# EAGLE design ep-project-team12-2 (EAGLE 9.6.2)

## Sheet 1 of 2
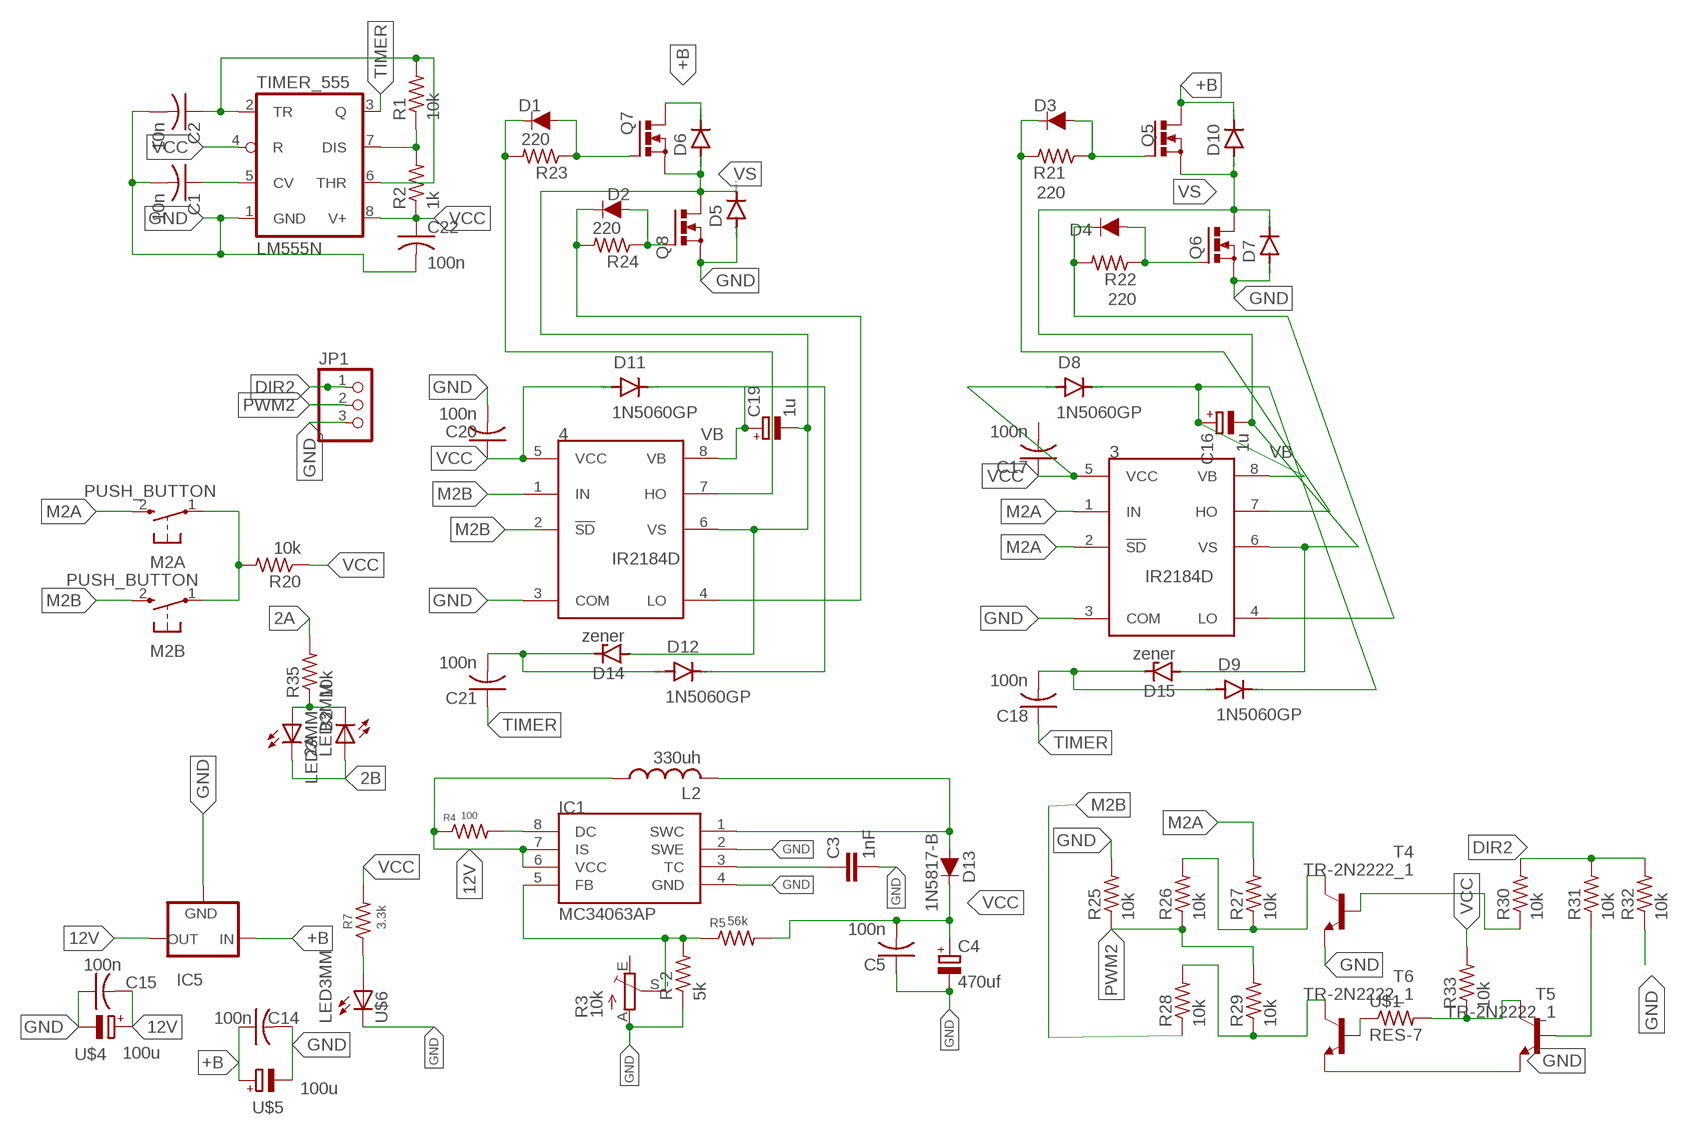
[diagram p0: schematic, sheet 1]

### Parts
2A  LED3MM  [LED3MM]
3  IR2184D  [DIL08]
4  IR2184D  [DIL08]
B2  LED3MM  [LED3MM]
C1  10n  C-US025-025X050  [C025-025X050]
C2  10n  C-US025-025X050  [C025-025X050]
C3  1nF  CAPACITOR  [C025-025X050]
C4  470uf  CAP_POL  [E3,5-8]
C5  100n  C-US025-025X050  [C025-025X050]
C14  100n  C-US025-025X050  [C025-025X050]
C15  100n  C-US025-025X050  [C025-025X050]
C16  1u  CPOL-EUE5-5  [E5-5]
C17  100n  C-US025-025X050  [C025-025X050]
C18  100n  C-US025-025X050  [C025-025X050]
C19  1u  CPOL-EUE5-5  [E5-5]
C20  100n  C-US025-025X050  [C025-025X050]
C21  100n  C-US025-025X050  [C025-025X050]
C22  100n  C-US025-025X050  [C025-025X050]
D1  1A/50V/1.1V  DIODE(1A)-PTH  [DIODE-1N4001]
D2  1A/50V/1.1V  DIODE(1A)-PTH  [DIODE-1N4001]
D3  1A/50V/1.1V  DIODE(1A)-PTH  [DIODE-1N4001]
D4  1A/50V/1.1V  DIODE(1A)-PTH  [DIODE-1N4001]
D5  BY396  [DO201-15]
D6  BY396  [DO201-15]
D7  BY396  [DO201-15]
D8  1N5060GP  [DO15-12]
D9  1N5060GP  [DO15-12]
D10  BY396  [DO201-15]
D11  1N5060GP  [DO15-12]
D12  1N5060GP  [DO15-12]
D13  1N5817-B  DIODE(1A)-PTH  [DIODE-1N4001]
D14  zener  BZD23  [SOD81]
D15  zener  BZD23  [SOD81]
IC1  MC34063AP  [DIL08]
IC5  78XXS  [78XXS]
JP1  PINHD-3_DATA  [1X03_DATA]
L2  330uh  L-USWE-TPC  [POWER-CHOKE_WE-TPC]
M2A  PUSH_BUTTON  [B3F-10XX]
M2B  PUSH_BUTTON  [B3F-10XX]
Q5  MOSFET_NTO220BV  [TO220BV]
Q6  MOSFET_NTO220BV  [TO220BV]
Q7  MOSFET_NTO220BV  [TO220BV]
Q8  MOSFET_NTO220BV  [TO220BV]
R1  10k  R-US_0204/7  [0204/7]
R2  1k  R-US_0204/7  [0204/7]
R3  10k  TRIM_EU-CA6V  [CA6V]
R4  100  RES-7  [0204/7]
R5  56k  RES-7  [0204/7]
R7  3.3k  RES-7  [0204/7]
R20  10k  R-US_0204/7  [0204/7]
R21  220  R-US_0204/7  [0204/7]
R22  220  R-US_0204/7  [0204/7]
R23  220  R-US_0204/7  [0204/7]
R24  220  R-US_0204/7  [0204/7]
R25  10k  R-US_0204/7  [0204/7]
R26  10k  R-US_0204/7  [0204/7]
R27  10k  R-US_0204/7  [0204/7]
R28  10k  R-US_0204/7  [0204/7]
R29  10k  R-US_0204/7  [0204/7]
R30  10k  R-US_0204/7  [0204/7]
R31  10k  R-US_0204/7  [0204/7]
R32  10k  R-US_0204/7  [0204/7]
R33  10k  R-US_0204/7  [0204/7]
R35  10k  R-US_0204/7  [0204/7]
R-2  5k  RES-7  [0204/7]
T4  TR-2N2222_1  [TO92-EBC]
T5  TR-2N2222_1  [TO92-EBC]
T6  TR-2N2222_1  [TO92-EBC]
TIMER_555  LM555N  [DIL08]
U$1  RES-7  [0204/7]
U$4  100u  CAP_POL  [E3,5-8]
U$5  100u  CAP_POL  [E3,5-8]
U$6  LED3MM  [LED3MM]

### Nets
2A: R35.2
2B: 2A.K(C) B2.A
12V: C15.2 IC1.6(VCC) IC1.7(IS) IC5.OUT L2.1 R4.1 U$4.+
+B: C14.1 D6.C D10.C IC5.IN Q5.D Q7.D U$5.+
DIR2: JP1.1 R30.2 R31.2 R32.2
GND: 3.3(COM) 4.3(COM) C1.2 C2.2 C3.2 C4.- C5.1 C14.2 C15.1 C20.2 C22.2 D5.A D7.A IC1.2(SWE) IC1.4(GND) IC5.GND JP1.3 Q6.S Q8.S R3.A R25.2 R32.1 R-2.1 T4.E T5.E T6.E TIMER_555.1(GND) U$4.- U$5.- U$6.K(C)
M2A: 3.1(IN) 3.2(!SD) M2A.2(S) R27.2
M2B: 4.1(IN) 4.2(!SD) M2B.2(S) R28.1
N$2: C1.1 TIMER_555.5(CV)
N$3: R1.1 R2.2 TIMER_555.7(DIS)
N$4: C2.1 R1.2 TIMER_555.2(TR) TIMER_555.6(THR)
N$5: D4.A Q6.G R22.1
N$6: 3.4(LO) D4.C R22.2
N$7: M2A.1(P) M2B.1(P) R20.2
N$8: T6.B U$1.1
N$9: C3.1 IC1.3(TC)
N$10: D13.A IC1.1(SWC) L2.2
N$11: 4.7(HO) D1.C R23.2
N$12: IC1.5(FB) R3.S R5.1 R-2.2
N$13: 4.4(LO) D2.C R24.2
N$15: IC1.8(DC) R4.2
N$16: R7.1 U$6.A
N$25: D3.A Q5.G R21.1
N$30: 3.7(HO) D3.C R21.2
N$31: C18.2 D9.A D15.C
N$32: D2.A Q8.G R24.1
N$33: D1.A Q7.G R23.1
N$36: C21.2 D12.A D14.C
N$37: R28.2 R29.1 T6.C
N$38: R26.2 R27.1 T4.C
N$39: R30.1 T4.B
N$40: R33.1 T5.C U$1.2
N$41: R31.1 T5.B
N$46: 2A.A B2.K(C) R35.1
PWM2: JP1.2 R25.1 R26.1 R29.2
TIMER: C18.1 C21.1 TIMER_555.3(Q)
VB: 3.8(VB) 4.8(VB) C16.+ C19.+ D8.C D9.C D11.C D12.C
VCC: 3.5(VCC) 4.5(VCC) C4.+ C5.2 C17.1 C20.1 C22.1 D8.A D11.A D13.C R2.1 R5.2 R7.2 R20.1 R33.2 TIMER_555.4(R) TIMER_555.8(V+)
VS: 3.6(VS) 4.6(VS) C16.- C19.- D5.C D6.A D7.C D10.A D14.A D15.A Q5.S Q6.D Q7.S Q8.D
Unconnected: C17.2 R3.E

## Sheet 2 of 2

## Library data of the parts
2A B2 = MIA_LIBRARY-2-2-2:LED3MM
3 4 = MIA_LIBRARY-2-2-2:IR2184
C1 C2 C5 C14 C15 C17 C18 C20-C22 = rcl8:C-US: CAPACITOR, American symbol; SPICEPREFIX: C
C3 = MIA_LIBRARY-2-2-2:CAPACITOR; SPICEPREFIX: C
C4 = MIA_LIBRARY-2-2-2:CAP_POL; SPICEPREFIX: C
C16 C19 = rcl8:CPOL-EU: POLARIZED CAPACITOR, European symbol; SPICEPREFIX: C
D1-D4 = MIA_LIBRARY-2-2-2:DIODE(1A): Diode These are standard reverse protection diodes and small signal diodes. SparkFun Products: SparkFun SparkPunk Sound Kit <https://www.sparkfun.com/products/11177> SparkFun ESP8266 Thing <https://www.sparkfun.com/products/13231>; PROD_ID: DIO-09176
D5-D7 D10 = diode:BY396: DIODE Si,100 V, 3 A
D8 D9 D11 D12 = diode:1N5060GP: DIODE controlled avalanche rectifier
D13 = MIA_LIBRARY-2-2-2:DIODE(1A): Diode These are standard reverse protection diodes and small signal diodes. SparkFun Products: SparkFun SparkPunk Sound Kit <https://www.sparkfun.com/products/11177> SparkFun ESP8266 Thing <https://www.sparkfun.com/products/13231>; PROD_ID: DIO-09176; SPICEPREFIX: D; VALUE: 1A/50V/1.1V
D14 D15 = diode:BZD23: Z DIODE
IC1 = MIA_LIBRARY-2-2-2:MC34063; SPICEPREFIX: X
IC5 = MIA_LIBRARY-2-2-2:78XXS: VOLTAGE REGULATOR
JP1 = MIA_LIBRARY-2-2-2:PINHD-3_DATA: PIN HEADER
L2 = rcl:L-US: INDUCTOR, American symbol; SPICEPREFIX: L
M2A M2B = MIA_LIBRARY-2-2-2:PUSH_BUTTON: OMRON SWITCH
Q5-Q8 = MIA_LIBRARY-2-2-2:MOSFET_N: Power MOSFET N-Channel
R1 R2 R20-R33 R35 = rcl8:R-US_: RESISTOR, American symbol; SPICEPREFIX: R
R3 = MIA_LIBRARY-2-2-2:TRIM_EU-: POTENTIOMETER; SPICEPREFIX: J
R4 R5 R7 = MIA_LIBRARY-2-2-2:RES-7; SPICEPREFIX: R
R-2 = MIA_LIBRARY-2-2-2:RES-7
T4-T6 = MIA_LIBRARY-2-2-2:TR-2N2222_1: NPN TRANSISTOR; SPICEPREFIX: J
TIMER_555 = linear:*555: TIMER
U$1 = MIA_LIBRARY-2-2-2:RES-7; SPICEPREFIX: B
U$4 U$5 = MIA_LIBRARY-2-2-2:CAP_POL
U$6 = MIA_LIBRARY-2-2-2:LED3MM; SPICEPREFIX: B

## Board
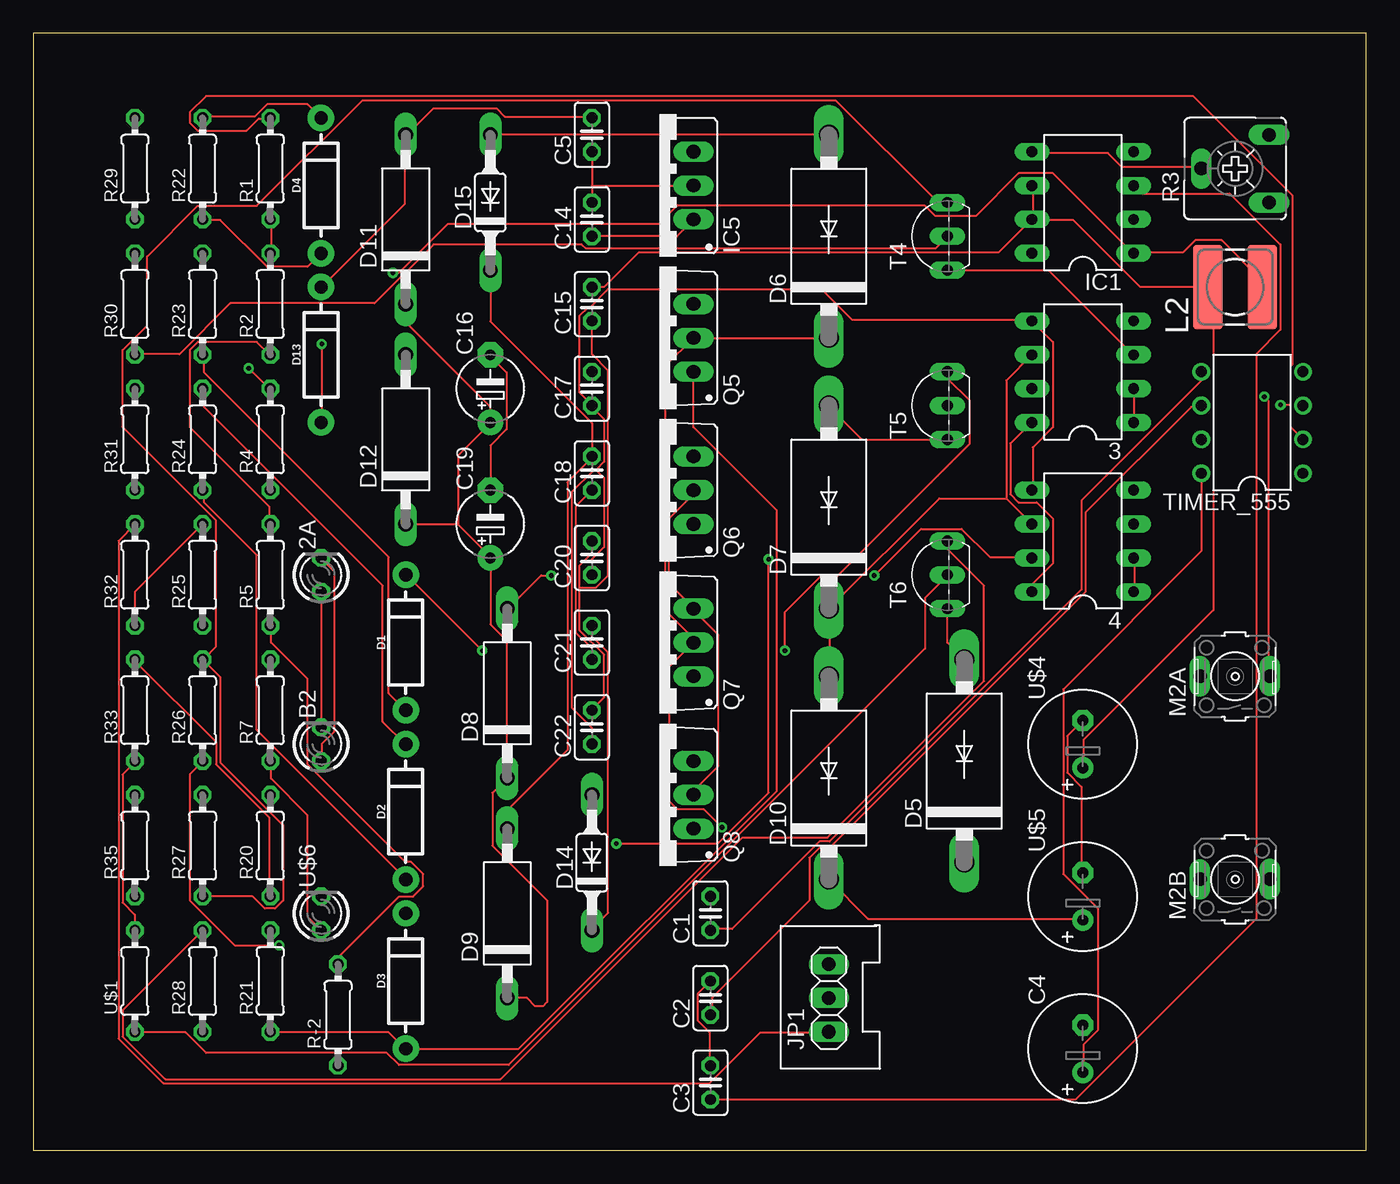
[diagram p1: board, top side]
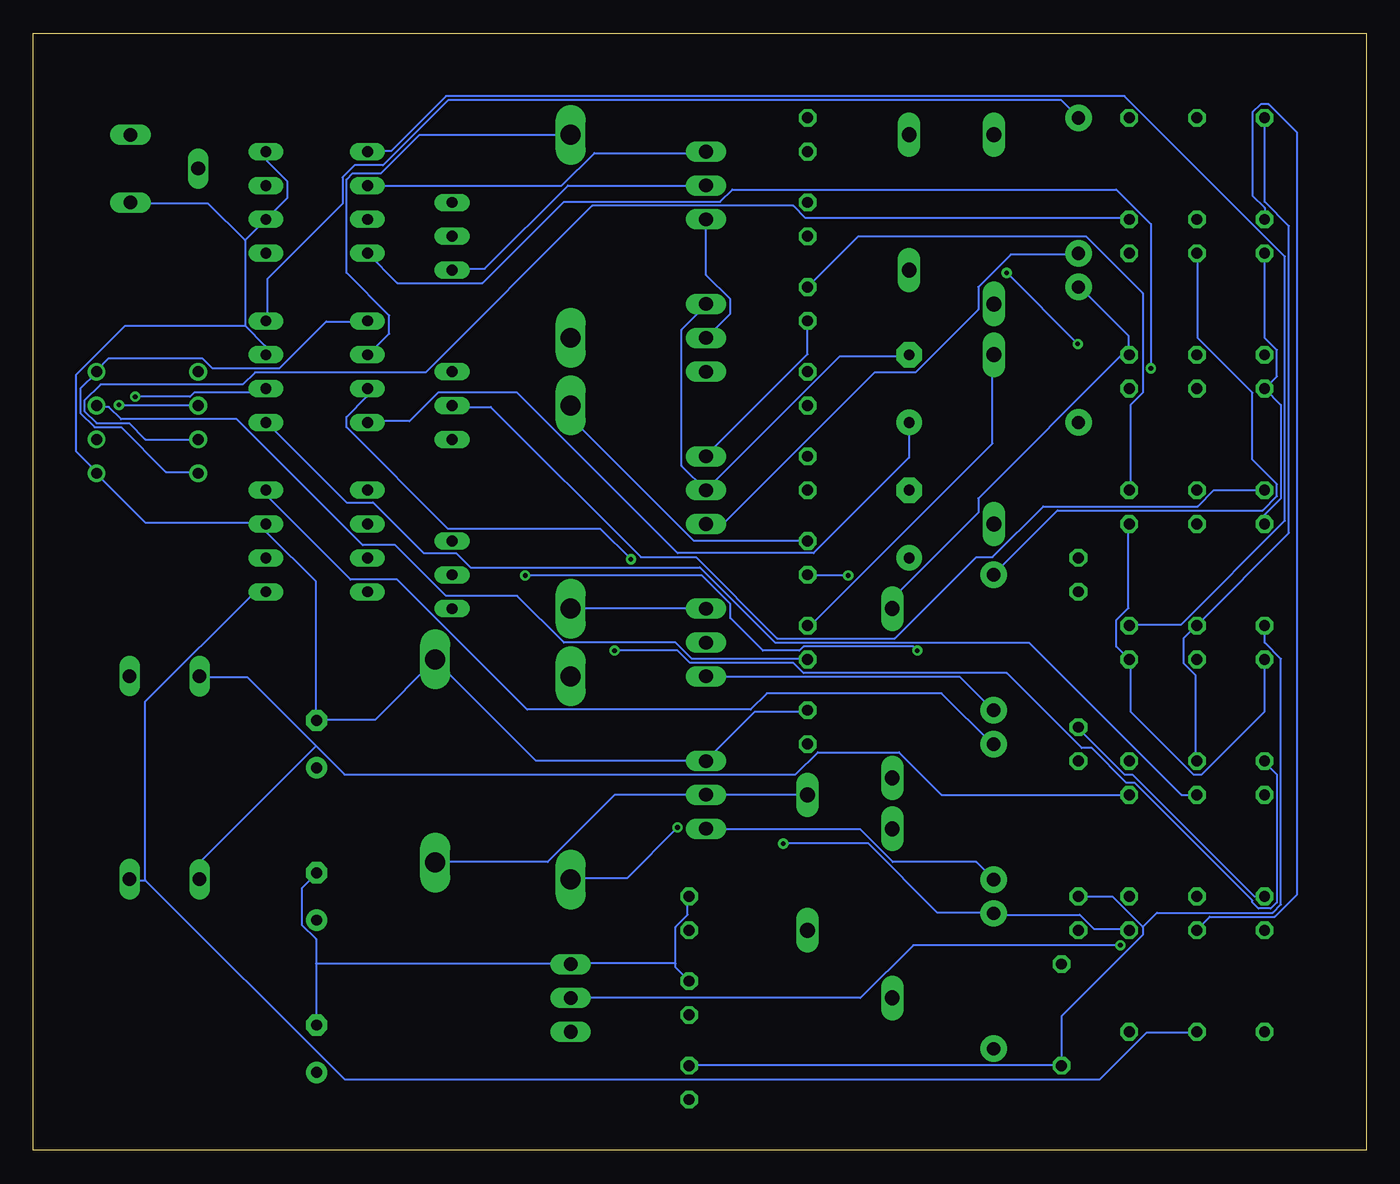
[diagram p2: board, bottom side, seen from below]

Size 100 x 83.81 mm. Coordinates in mm from the lower left corner, seen from the top.
Outline: 0,0 100,0 100,83.81 0,83.81 0,0
Copper layers (1*16): Top 0.035mm / dielectric 1.7mm / Bottom 0.035mm
Design rules "default *": minimum track width 6mil, minimum drill 0.35mm, track to track 6mil, track to pad 6mil, pad to pad 6mil, via to via 6mil, smd to smd 6mil, copper to edge 40mil, drill to drill 6mil, minimum pad ring 10mil, minimum via ring 8mil, stop-mask expansion 4mil, vias tented up to drill 0mil, thermal gap 10mil

### Footprints (pad centres in the part's own frame; a part is rotated, then mirrored left to right if it is on the bottom)
LED3MM = drill 0.813 octagon: A -1.27,0; K 1.27,0
DIL08 = drill 0.813 long: 1 -3.81,-3.81; 2 -1.27,-3.81; 3 1.27,-3.81; 4 3.81,-3.81; 5 3.81,3.81; 6 1.27,3.81; 7 -1.27,3.81; 8 -3.81,3.81
C025-025X050 = drill 0.813 octagon: 1 -1.27,0; 2 1.27,0
E3,5-8 = drill 0.813 pad 1.6: + -1.778,0 | drill 0.813 pad 1.6 octagon: - 1.778,0
E5-5 = drill 0.813 pad 1.905: + -2.54,0 | drill 0.813 pad 1.905 octagon: - 2.54,0
DIODE-1N4001 = drill 1 pad 1.981: A -5.08,0; C 5.08,0
DO201-15 = drill 1.499 long: A 7.62,0; C -7.62,0
DO15-12 = drill 1.118 long: A 6.35,0; C -6.35,0
SOD81 = drill 1.118 long: A 5.08,0; C -5.08,0
78XXS = drill 1.016 long: GND 0,-2.54; IN -2.54,-2.54; OUT 2.54,-2.54
1X03_DATA = drill 1.016 long: 1 -2.54,0; 2 0,0; 3 2.54,0
POWER-CHOKE_WE-TPC = smd 6.3 x 2.2: 1 0,2.05; 2 0,-2.05
B3F-10XX = drill 1.016 long: 1 0.013,2.636; 2 0.029,-2.605
TO220BV = drill 1.016 long: D 0,-2.54; G -2.54,-2.54; S 2.54,-2.54
0204/7 = drill 0.813 octagon: 1 -3.81,0; 2 3.81,0
CA6V = drill 1.016 long: A -2.54,-2.54; E 2.54,-2.54; S 0,2.54
TO92-EBC = drill 0.813 long: B 0,-1.27; C 2.54,-1.27; E -2.54,-1.27
DIL08' = drill 0.813 pad 1.27: 1 -3.81,-3.81; 2 -1.27,-3.81; 3 1.27,-3.81; 4 3.81,-3.81; 5 3.81,3.81; 6 1.27,3.81; 7 -1.27,3.81; 8 -3.81,3.81

### Placement (x,y rotation side)
2A  21.59,43.18 90 top
3  78.74,58.42 90 top
4  78.74,45.72 90 top
B2  21.59,30.48 90 top
C1  50.8,17.78 90 top
C2  50.8,11.43 90 top
C3  50.8,5.08 90 top
C4  78.74,7.62 90 top
C5  41.91,76.2 90 top
C14  41.91,69.85 90 top
C15  41.91,63.5 90 top
C16  34.29,57.15 90 top
C17  41.91,57.15 90 top
C18  41.91,50.8 90 top
C19  34.29,46.99 90 top
C20  41.91,44.45 90 top
C21  41.91,38.1 90 top
C22  41.91,31.75 90 top
D1  27.94,38.1 90 top
D2  27.94,25.4 90 top
D3  27.94,12.7 90 top
D4  21.59,72.39 90 top
D5  69.85,29.21 90 top
D6  59.69,68.58 90 top
D7  59.69,48.26 90 top
D8  35.56,34.29 90 top
D9  35.56,17.78 90 top
D10  59.69,27.94 90 top
D11  27.94,69.85 90 top
D12  27.94,53.34 90 top
D13  21.59,59.69 90 top
D14  41.91,21.59 90 top
D15  34.29,71.12 90 top
IC1  78.74,71.12 90 top
IC5  46.99,72.39 90 top
JP1  59.69,11.43 90 top
L2  90.17,64.77 90 top
M2A  90.17,35.56 90 top
M2B  90.17,20.32 90 top
Q5  46.99,60.96 90 top
Q6  46.99,49.53 90 top
Q7  46.99,38.1 90 top
Q8  46.99,26.67 90 top
R1  17.78,73.66 90 top
R2  17.78,63.5 90 top
R3  90.17,73.66 90 top
R4  17.78,53.34 90 top
R5  17.78,43.18 90 top
R7  17.78,33.02 90 top
R20  17.78,22.86 90 top
R21  17.78,12.7 90 top
R22  12.7,73.66 90 top
R23  12.7,63.5 90 top
R24  12.7,53.34 90 top
R25  12.7,43.18 90 top
R26  12.7,33.02 90 top
R27  12.7,22.86 90 top
R28  12.7,12.7 90 top
R29  7.62,73.66 90 top
R30  7.62,63.5 90 top
R31  7.62,53.34 90 top
R32  7.62,43.18 90 top
R33  7.62,33.02 90 top
R35  7.62,22.86 90 top
R-2  22.86,10.16 90 top
T4  67.31,68.58 90 top
T5  67.31,55.88 90 top
T6  67.31,43.18 90 top
TIMER_555  LM555N  [DIL08']  91.44,54.61 90 top
U$1  7.62,12.7 90 top
U$4  78.74,30.48 90 top
U$5  78.74,19.05 90 top
U$6  21.59,17.78 90 top

### Tracks (layer width: path | path; a pad name or v marks a point on that pad's centre or on a via)
2B
  Top 0.152: B2.A 21.64,29.26 21.64,30.48 22.55,31.39 22.55,43.43 21.64,44.35 2A.K
12V
  Top 0.152: IC1.7 74.98,69.95 74.98,72.39 IC1.6 | U$4.+ 78.79,28.8 78.79,30.79 88.54,40.54 88.54,64.47 88.24,64.77 L2.1 83.06,64.77 78.03,69.8 74.98,69.8 IC1.7 | C15.2 42.82,64.77 45.41,67.36 72.39,67.36 74.83,69.8 IC1.7
  Bottom 0.152: C15.2 38.1,68.58 21.03,68.58 16.76,64.31 16.76,56.84 17.68,55.93 17.68,49.53 R4.1 | IC1.6 60.35,72.39 57.91,74.83 49.53,74.83 IC5.OUT
+B  (via drill 0.35)
  Top 0.152: D10.C 62.64,17.37 78.64,17.37 U$5.+ | C14.1 48.31,68.58 49.53,69.8 IC5.IN | D6.C Q5.D 47.4,58.83 47.4,40.54 49.53,38.41 Q7.D 47.7,36.27 47.7,26.21 48.31,25.6 50.29,25.6 v51.66,24.23
  Bottom 0.152: IC5.IN 49.53,65.68 47.7,63.86 47.7,62.79 Q5.D | v51.66,24.23 55.47,20.42 59.59,20.42 D10.C
DIR2
  Top 0.152: JP1.1 59.59,8.84 54.56,8.84 50.75,5.03 9.75,5.03 6.4,8.38 6.4,45.72 7.62,46.94 R32.2
  Bottom 0.152: R32.2 7.62,47.7 6.4,48.92 6.4,55.93 R31.2 6.71,58.06 6.71,60.05 7.62,60.96 R30.2
GND
  Top 0.152: C5.1 41.91,72.39 | 41.91,72.39 C14.2 | 41.91,72.39 IC5.GND | T4.E 68.58,65.99 76.2,65.99 82.45,59.74 3.3 | T5.E 62.18,53.34 59.74,55.78 D7.A | C20.2 41.91,44.81 41,43.89 41,42.22 | 41,42.22 41,39.01 42.82,37.19 42.82,33.98 41.91,33.07 C22.2 | C15.1 41.91,59.74 43.13,58.52 43.13,43.13 42.22,42.22 41,42.22 | R32.1 7.62,41.91 R25.2 | C2.2 49.84,11.73 49.84,9.75 50.75,8.84 50.75,6.4 C3.2 | T6.E 68.58,38.1 D5.A | U$4.- 77.57,31.09 77.57,28.35 78.64,27.28 78.64,20.88 U$5.-
  Bottom 0.152: 84.12,61.87 82.6,60.35 82.6,59.74 3.3 | 84.12,68.28 84.12,61.87 | 84.12,68.28 IC1.2 80.92,71.48 80.92,72.69 82.45,74.22 82.45,74.83 IC1.4 | 84.12,68.28 86.87,71.02 92.66,71.02 R3.A | IC5.GND 59.89,72.39 66.14,66.14 68.58,66.14 T4.E | C15.1 41.91,59.74 49.53,52.12 Q6.S | 49.53,29.26 45.87,32.92 41.91,32.92 C22.2 | C20.2 50.44,45.72 59.59,54.86 59.59,55.78 D7.A | 22.86,6.4 22.86,10.06 16.76,16.15 16.76,16.76 | 16.76,16.76 19.05,19.05 U$6.K | R32.1 7.62,38.1 6.4,36.88 6.4,18.44 7.01,17.83 15.7,17.83 16.76,16.76 | 51.82,14.02 51.82,13.72 C2.2 | 51.82,14.02 51.82,16.76 50.9,17.68 50.9,19.05 C1.2 | 51.82,14.02 59.59,14.02 JP1.3 59.74,14.02 78.79,14.02 | 78.79,14.02 78.79,15.85 79.86,16.92 79.86,19.66 78.79,20.73 U$5.- | 78.79,14.02 78.79,9.45 C4.- | 22.86,6.4 50.75,6.4 C3.2 | 22.86,6.4 R-2.1 | 49.53,29.26 62.33,29.26 69.8,36.73 D5.A 74.37,32.31 78.64,32.31 U$4.- 78.79,32.31 78.79,42.67 82.45,46.33 82.45,46.94 4.3 82.6,47.09 91.59,47.09 95.25,50.75 TIMER_555.1 95.25,50.9 96.77,52.43 96.77,58.22 93.12,61.87 84.12,61.87 | 49.53,29.26 Q8.S
M2A  (via drill 0.35)
  Top 0.152: 3.2 82.6,57.15 82.6,54.71 3.1 | v92.35,56.54 92.66,56.24 92.66,35.66 M2A.2
  Bottom 0.152: R27.2 13.87,26.67 25.3,38.1 44.35,38.1 49.99,43.74 67.21,43.74 68.28,44.81 70.71,44.81 74.52,48.62 76.5,48.62 82.45,54.56 3.1 | v92.35,56.54 88.24,56.54 87.94,56.84 82.91,56.84 82.6,57.15 3.2
M2B
  Top 0.152: 4.1 82.6,41.91 82.6,44.35 4.2
  Bottom 0.152: 91.59,20.27 76.66,5.33 19.96,5.33 16.46,8.84 12.8,8.84 R28.1 | 91.59,20.27 92.66,20.27 M2B.2 | 4.1 83.36,41.91 91.59,33.68 91.59,20.27
N$2
  Top 0.152: TIMER_555.5 87.63,57.76 78.64,48.77 78.64,42.06 59.74,23.16 58.98,23.16 52.43,16.61 50.9,16.61 C1.1
N$3
  Top 0.152: R2.2 17.83,67.36 17.83,69.8 R1.1
  Bottom 0.152: TIMER_555.7 91.59,53.34 92.81,54.56 95.25,54.56 96.16,55.47 96.16,56.24 94.94,57.45 84.28,57.45 83.36,58.37 70.56,58.37 58.06,70.87 42.98,70.87 42.06,69.95 17.83,69.95 R1.1
N$4  (via drill 0.35)
  Top 0.152: C2.1 50.9,10.21 50.9,11.43 58.22,18.75 58.22,21.95 59.13,22.86 59.89,22.86 78.94,41.91 78.94,47.85 86.87,55.78 87.63,55.78 TIMER_555.6 | 94.34,55.93 94.34,54.25 TIMER_555.2 | 94.34,55.93 94.34,58.83 94.49,58.98 94.49,71.63 87.02,79.1 12.95,79.1 11.73,77.88 11.73,77.11 12.34,76.5 16,76.5 16.92,77.42 17.68,77.42 R1.2 | 94.34,55.93 v93.57,55.93
  Bottom 0.152: v93.57,55.93 87.63,55.93 TIMER_555.6
N$5
  Top 0.152: D4.A 20.57,66.29 17.53,66.29 14.02,69.8 12.8,69.8 R22.1
  Bottom 0.152: Q6.G 49.53,47.09 48.16,47.09 36.88,58.37 33.83,58.37 29.11,63.09 29.11,64.77 26.67,67.21 21.64,67.21 D4.A
N$6
  Top 0.152: D4.C 20.57,78.49 17.53,78.49 16.61,77.57 12.8,77.57 R22.2
  Bottom 0.152: 3.4 82.45,62.33 82.45,65.38 76.81,71.02 76.81,73 75.89,73.91 73.76,73.91 68.89,78.79 22.86,78.79 21.64,77.57 D4.C
N$7
  Bottom 0.152: R20.2 31.85,26.67 35.05,29.87 41.15,29.87 42.82,28.19 76.66,28.19 78.79,30.33 | 78.79,30.33 83.97,35.51 87.48,35.51 M2A.1 | 78.79,30.33 87.48,21.64 87.48,20.42 M2B.1
N$8
  Top 0.152: U$1.1 7.62,8.84 11.43,8.84 12.95,7.32 26.52,7.32 27.43,6.4 35.66,6.4 66.9,37.64 66.9,41.45 68.58,43.13 T6.B
N$9
  Top 0.152: C3.1 78.18,3.81 91.75,17.37 91.75,59.74 93.57,61.57 93.57,67.97 89.76,71.78 83.21,71.78 82.6,72.39 IC1.3
N$10  (via drill 0.35)
  Top 0.152: L2.2 92.2,64.77 92.2,65.23 89.15,68.28 87.17,68.28 86.26,67.36 82.6,67.36 IC1.1 82.45,67.36 76.5,73.3 73.91,73.3 70.71,70.1 67.67,70.1 66.9,70.87 48.31,70.87 46.94,69.49 31.09,69.49 27.43,65.84 v26.98,65.84 | v21.64,60.5 21.64,54.71 D13.A
  Bottom 0.152: v26.98,65.84 v21.64,60.5
N$11  (via drill 0.35)
  Top 0.152: v63.09,43.13 66.6,46.63 69.65,46.63 71.78,44.5 74.83,44.5 4.7 | v33.68,37.49 28.04,43.13 D1.C
  Bottom 0.152: R23.2 12.65,67.21 12.65,60.96 8.53,56.84 8.53,51.82 6.71,49.99 6.71,49.07 7.77,48.01 23.16,48.01 27.89,43.28 D1.C | v63.09,43.13 49.84,43.13 47.7,41 47.7,39.93 45.26,37.49 42.52,37.49 42.22,37.8 33.98,37.8 v33.68,37.49
N$12
  Top 0.152: IC1.5 74.98,74.83 80.62,74.83 81.69,73.76 87.63,73.76 R3.S | R-2.2 22.86,14.48 27.43,19.05 28.5,19.05 29.26,19.81 29.26,20.73 28.35,21.64 27.89,21.64 20.57,28.96 20.57,35.36 17.83,38.1 17.83,39.32 R5.1
  Bottom 0.152: IC1.5 74.83,74.98 73.15,74.98 69.04,79.1 18.14,79.1 6.1,67.06 6.1,47.24 13.87,39.47 17.68,39.47 R5.1
N$13
  Top 0.152: R24.2 12.8,57.15 12.8,55.78 26.21,42.37 26.21,32.16 27.89,30.48 D2.C
  Bottom 0.152: 4.4 82.45,49.53 82.45,49.07 76.2,42.82 72.69,42.82 62.94,33.07 46.18,33.07 44.96,34.29 31.85,34.29 28.04,30.48 D2.C
N$15  (via drill 0.35)
  Top 0.152: v16.15,58.67 17.68,57.15 R4.2
  Bottom 0.152: v16.15,58.67 16.15,69.49 18.75,72.08 47.55,72.08 48.46,71.17 60.2,71.17 66.29,65.08 72.69,65.08 IC1.8
N$16
  Top 0.152: U$6.A 20.57,17.53 20.57,25.15 17.83,27.89 17.83,29.11 R7.1
N$25
  Top 0.152: R21.1 17.83,8.84 26.67,8.84 27.89,7.62 D3.A 36.42,7.62 55.78,26.98 55.78,48.01 49.53,54.25 Q5.G
N$30  (via drill 0.35)
  Top 0.152: v55.17,44.35 55.17,26.82 51.36,23.01 v43.74,23.01
  Bottom 0.152: R21.2 17.83,16.61 20.42,16.61 21.49,17.68 27.89,17.68 D3.C 28.04,17.83 32.16,17.83 37.34,23.01 v43.74,23.01 | v55.17,44.35 57.45,46.63 68.89,46.63 76.5,54.25 76.5,55.02 74.98,56.54 74.98,57.15 3.7
N$31
  Top 0.152: D15.C 34.29,62.18 41.91,54.56 C18.2 41.91,51.97 40.08,50.14 40.08,30.02 35.66,25.6 35.66,24.23 D9.A
N$32
  Top 0.152: R24.1 12.8,49.53 12.8,48.62 16.76,44.65 16.76,31.55 27.89,20.42 D2.A
  Bottom 0.152: D2.A 29.26,21.64 35.51,21.64 37.95,24.08 49.53,24.08 Q8.G
N$33
  Top 0.152: D1.A 26.67,34.29 26.67,44.5 12.8,58.37 12.8,59.59 R23.1
  Bottom 0.152: Q7.G 49.53,35.51 30.48,35.51 28.04,33.07 D1.A
N$36
  Top 0.152: C21.2 41.91,38.56 43.13,37.34 43.13,17.83 41.91,16.61 D14.C
  Bottom 0.152: D12.A 28.04,59.59 28.04,53.03 41.6,39.47 41.91,39.47 C21.2
N$37
  Top 0.152: T6.C 68.58,45.11 71.32,42.37 71.32,35.2 59.59,23.47 53.19,23.47 35.05,5.33 9.91,5.33 6.71,8.53 6.71,10.52 R28.2
  Bottom 0.152: R29.1 7.62,70.71 8.53,71.63 8.53,77.88 7.92,78.49 7.32,78.49 5.18,76.35 5.18,19.2 6.86,17.53 11.73,17.53 12.65,16.61 R28.2
N$38
  Top 0.152: R27.1 16.46,19.05 17.37,18.14 18.14,18.14 18.75,18.75 18.75,24.38 14.02,29.11 14.02,35.51 R26.2 12.8,36.88 13.72,37.8 13.72,47.24 6.71,54.25 6.71,60.05 8.53,61.87 8.53,67.06 12.34,70.87 16.76,70.87 24.69,78.79 60.2,78.79 67.82,71.17 68.58,71.17 T4.C
N$39
  Top 0.152: T4.B 67.67,67.67 41.45,67.67 41.15,67.97 30.02,67.97 25.6,63.55 14.78,63.55 10.97,59.74 7.62,59.74 R30.1
N$40  (via drill 0.35)
  Top 0.152: U$1.2 7.62,17.68 6.71,18.59 6.71,28.19 7.62,29.11 R33.1 | T5.C 68.58,57.91 70.26,56.24 70.26,53.03 60.35,43.13 59.13,43.13 56.39,40.39 v56.39,37.49
  Bottom 0.152: v56.39,37.49 51.66,37.49 50.75,36.58 42.98,36.58 42.22,35.81 26.98,35.81 21.34,30.18 20.57,30.18 17.98,27.58 17.37,27.58 8.53,18.75 8.53,18.59 8.08,18.14 7.16,18.14 6.71,18.59 6.71,28.19 7.62,29.11 R33.1
N$41
  Bottom 0.152: R31.1 11.43,49.53 12.65,48.31 24.23,48.31 28.04,44.5 29.26,44.5 35.36,38.41 44.2,38.41 50.29,44.5 54.41,44.5 65.68,55.78 68.58,55.78 T5.B
N$46
  Top 0.152: 2A.A 21.64,41.91 21.64,31.85 B2.K
  Bottom 0.152: R35.1 8.38,19.05 17.53,28.19 18.14,28.19 21.64,31.7 B2.K
PWM2  (via drill 0.35)
  Top 0.152: v18.44,15.39 15.09,15.39 11.73,18.75 11.73,28.19 12.65,29.11 R26.1
  Bottom 0.152: R26.1 12.8,29.26 12.8,35.66 13.72,36.58 13.72,38.41 12.8,39.32 R25.1 12.65,39.47 5.79,46.33 5.79,69.34 7.62,71.17 R29.2 | JP1.2 37.95,11.43 33.98,15.39 v18.44,15.39
TIMER
  Top 0.152: C21.1 41.91,37.64 40.69,38.86 40.69,48.31 C18.1
  Bottom 0.152: TIMER_555.3 95.25,55.78 94.34,55.78 93.42,54.86 84.73,54.86 75.29,45.41 72.85,45.41 69.04,41.6 63.7,41.6 60.2,38.1 51.82,38.1 50.6,36.88 41.91,36.88 C21.1
VB
  Top 0.152: D9.C 37.03,11.43 37.64,10.82 38.25,10.82 38.56,11.12 38.56,18.75 34.44,22.86 34.44,26.82 D8.C 35.51,28.04 35.51,38.25 34.29,39.47 C19.+ 34.29,44.5 31.85,46.94 | 4.8 74.98,41.91 74.98,42.52 76.5,44.04 76.5,47.4 75.29,48.62 73.91,48.62 73.3,49.23 73.3,53.03 74.83,54.56 3.8 | 31.85,46.94 28.04,46.94 D12.C | D11.C 28.04,63.4 28.04,62.03 34.29,55.78 C16.+ 34.29,54.56 31.85,52.12 31.85,46.94
  Bottom 0.152: C16.+ 34.29,51.97 41.45,44.81 51.66,44.81 63.7,56.84 69.65,56.84 71.78,54.71 74.83,54.71 3.8
VCC  (via drill 0.35)
  Top 0.152: 4.5 74.98,49.53 74.98,52.73 76.5,54.25 76.5,60.66 3.5 74.83,62.33 61.42,62.33 59.13,64.62 43.13,64.62 41.76,63.25 41.6,63.25 41,62.64 41,56.84 41.91,55.93 C17.1 41.91,55.78 42.82,54.86 42.82,51.66 42.22,51.05 | TIMER_555.8 87.63,44.96 77.27,34.59 77.27,20.73 79.86,18.14 79.86,8.99 78.79,7.92 78.79,5.94 C4.+ | R20.1 17.68,19.05 17.68,24.99 13.72,28.96 13.72,30.63 7.62,36.73 R33.2 | C22.1 41.91,31.7 40.39,33.22 40.39,49.38 42.06,51.05 42.22,51.05 | C20.1 41.91,44.35 42.82,45.26 42.82,50.44 42.22,51.05 | C5.2 41.91,77.57 35.36,77.57 34.75,78.18 30.02,78.18 28.04,76.2 D11.A 27.89,76.2 27.89,71.02 21.64,64.77 D13.C | v38.86,43.13 38.1,43.13 35.66,40.69 D8.A | R5.2 17.68,47.09 17.68,48.31 11.73,54.25 11.73,60.05 12.34,60.66 16.76,60.66 17.68,59.74 R2.1
  Bottom 0.152: TIMER_555.8 87.63,50.9 90.07,50.9 93.42,54.25 95.4,54.25 96.47,55.32 96.47,57.15 95.25,58.37 TIMER_555.4 95.25,58.52 94.34,59.44 87.33,59.44 86.56,58.67 81.53,58.67 78.03,62.18 74.98,62.18 3.5 | R33.2 7.62,32.92 12.34,28.19 12.95,28.19 17.68,32.92 17.68,36.73 R7.2 18.75,37.8 18.75,39.78 17.83,40.69 17.83,46.94 R5.2 | D13.C 21.49,64.77 17.83,61.11 17.83,59.74 R2.1 17.83,59.59 18.44,59.59 29.11,48.92 29.11,47.85 35.51,41.45 35.51,40.69 D8.A | v38.86,43.13 41.91,43.13 C20.1
VS
  Top 0.152: D6.A D15.A | C19.- 34.29,52.88 35.51,54.1 35.51,58.37 34.29,59.59 C16.- | 73,48.92 4.6 | 73,48.92 73,57.76 3.6 | Q6.D 49.53,49.23 47.7,47.4 47.7,42.52 49.53,40.69 Q7.S 49.53,40.54 51.36,38.71 51.36,28.8 49.53,26.98 Q8.D | D10.A 59.74,35.66 59.74,40.54 D7.C 67.97,48.92 73,48.92
  Bottom 0.152: D14.A Q8.D 56.39,26.67 61.42,21.64 69.8,21.64 D5.C | Q7.S 49.53,40.69 59.59,40.69 D7.C | Q5.S 49.53,63.4 51.36,61.57 51.36,51.36 Q6.D 39.47,59.59 34.29,59.59 C16.- | D6.A 71.02,76.2 73.91,73.3 76.05,73.3 76.5,72.85 76.5,65.84 73.3,62.64 73.3,61.27 74.83,59.74 3.6